# Altium schematic sheet Sheet1.SchDoc
size A4; SheetNumber: 1; SheetTotal: 1
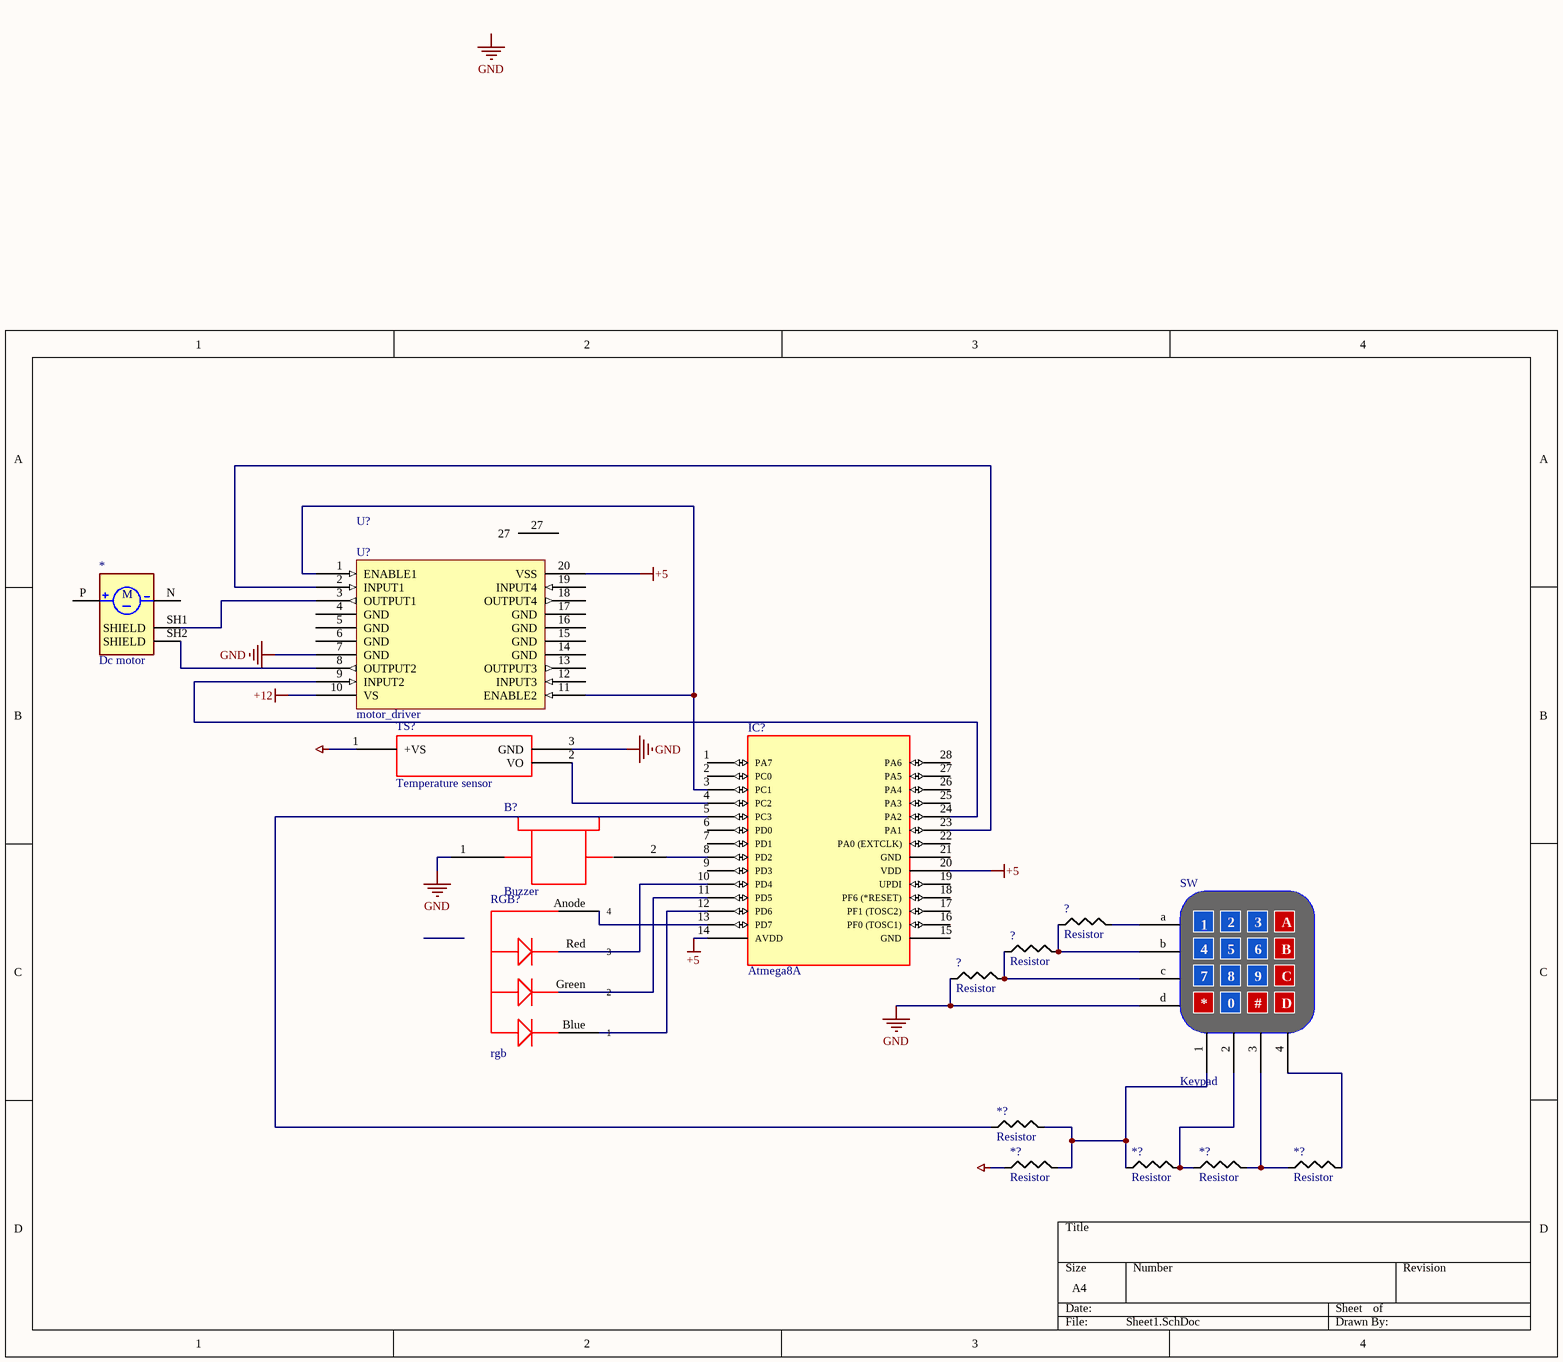
[diagram p0: Sheet1.SchDoc]

## Parts
(Parts that share a designator on the sheet are numbered #1, #2 ... from top to bottom, then left to right.)
*  Dc motor  [Dc motor]
*?#1  Resistor  [resistor]
*?#2  Resistor  [resistor]
*?#3  Resistor  [resistor]
*?#4  Resistor  [resistor]
*?#5  Resistor  [resistor]
?#1  Resistor  [resistor]
?#2  Resistor  [resistor]
?#3  Resistor  [resistor]
B?  Buzzer  [Buzzer]
IC?  Atmega8A  [ATmega8a]
RGB?  rgb  [rgb]
SW  Keypad  [Keypad]
TS?  Temperature sensor  [Temperature sensor]
U?  motor_driver  [motor_driver]

## Nets
+5: IC?.14(AVDD) IC?.20(VDD) U?.20(VSS)
+12: U?.10(VS)
GND: ?#3.15 B?.1 SW.d TS?.3(GND) U?.7(GND)
Net*?#2_15: *?#2.15 TS?.1(+VS)
Net*?#1_14: *?#1.14 *?#2.14 *?#3.15 SW.1
Net*?#1_15: *?#1.15 IC?.5(PC3)
Net*?#3_14: *?#3.14 *?#4.15 SW.2
Net*?#4_14: *?#4.14 *?#5.15 SW.3
Net*?#5_14: *?#5.14 SW.4
Net*_SH1: *.SH1(SHIELD) U?.3(OUTPUT1)
Net*_SH2: *.SH2(SHIELD) U?.8(OUTPUT2)
Net?#1_14: ?#1.14 SW.a
Net?#1_15: ?#1.15 ?#2.14 SW.b
Net?#2_15: ?#2.15 ?#3.14 SW.c
NetB?_2: B?.2 IC?.8(PD2)
NetIC?_3: IC?.3(PC1) U?.1(ENABLE1) U?.11(ENABLE2)
NetIC?_4: IC?.4(PC2) TS?.2(VO)
NetIC?_10: IC?.10(PD4) RGB?.Red(3)
NetIC?_11: IC?.11(PD5) RGB?.Green(2)
NetIC?_23: IC?.23(PA1) U?.2(INPUT1)
NetIC?_24: IC?.24(PA2) U?.9(INPUT2)

Not connected (* = marked no-connect by the designer): * N(NEG) P(POS); IC? 1(PA7) 2(PC0) 6(PD0) 7(PD1) 9(PD3) 12(PD6) 13(PD7) 15(GND) 16(PF0_(TOSC1)) 17(PF1_(TOSC2)) 18(PF6_(*RESET)) 19(UPDI) 21(GND) 22(PA0_(EXTCLK)) 25(PA3) 26(PA4) 27(PA5) 28(PA6); RGB? Anode(4) Blue(1); U? 4(GND) 5(GND) 6(GND) 12(INPUT3) 13(OUTPUT3) 14(GND) 15(GND) 16(GND) 17(GND) 18(OUTPUT4) 19(INPUT4) 27

## Notes on the sheet
- Labels drawn without touching a wire or pin: GND
- (in symbol Dc motor) M
- (in symbol Keypad) A; B; C; D; 0; #

## Library data of the parts
* = Dc motor: SMD HD MOTOR 3VDC 15000RPM,DC Motor Vibration, ERM 15000 RPM 2.7VDC; Manufacturer Product Number: HD-EMB1104-SM-3; Manufacturer: PUI Audio, Inc.; supplier: DigiKey; DigiKey Part Number: 668-HD-EMB1104-SM-3TR-ND
*?#1-*?#5 ?#1-?#3 = Resistor: Manufacturer: Stackpole Electronics Inc; Mfr. Part number: CF14JT10K0; Supplier: DigiKey; Supplier part number: CF14JT10K0TR-ND
B? = Buzzer: Manufacturer: PUI Audio, Inc.; Manufacturer part number: AT-1224-TWT-5V-2-R; Supplier: DigiKey; Supplier part number: 668-1470-ND
IC? = Atmega8A: Manufacturer: Microchip Technology; Manufacturer part number: ATMEGA808-XUR; Supplier: DigiKey; Supplier part number: 150-ATMEGA808-XURCT-ND
RGB? = rgb: Manufacturer: Cree LED; Manufacturer part number: UHD1110-FKA-CL1A13R3Q1BBQFMF3; Supplier: DigiKey; Supplier part number: UHD1110-FKA-CL1A13R3Q1BBQFMF3CT-ND
SW = Keypad: SWITCH KEYPAD 4X4; Manufacturer: Gearbox Labs; Mfr. Part number: PART 4X4 KEYPAD; Supplier: DigiKey; Supplier part number: 4166-PART4X4KEYPAD-ND
TS? = Temperature sensor: Manufacturer: Texas Instruments; Manufacturer part number: LM35DZ/LFT4; Supplier: DigiKey; Supplier part number: 296-43342-ND
U? = motor_driver: IC MTR DRV BIPOLR 4.5-36V 20SOIC, Bipolar Motor Driver Parallel 20-SO; Manufacturer Product Number: L293DD; Manufacturer: STMicroelectronics; DigiKey Part Number: 497-1390-5-ND; supplier: DigiKey